# EAGLE design PAM8016-breakout (EAGLE 9.5.2)
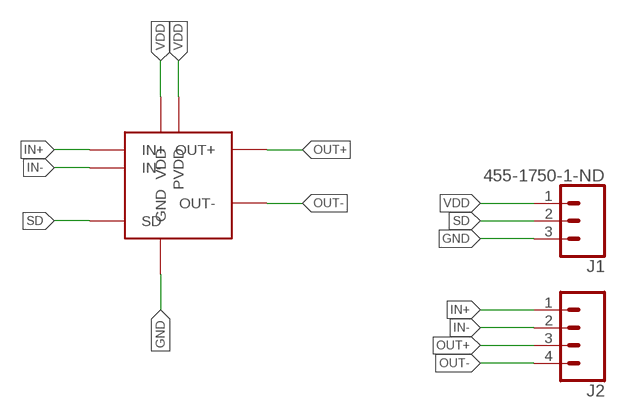
[diagram p0: schematic, sheet 1]

## Parts
J1  455-1750-1-ND  CONN_03  [1X03]
J2  CONN_04  [1X04]
U$1  PAM8016  [U-FLGA1515-9]

## Nets
GND: J1.3 U$1.A2(GND) U$1.B3(GND)
IN+: J2.1 U$1.A1(IN+)
IN-: J2.2 U$1.C1(IN-)
OUT+: J2.3 U$1.C3(OUT+)
OUT-: J2.4 U$1.A3(OUT-)
SD: J1.2 U$1.C2(SD)
VDD: J1.1 U$1.B1(VDD) U$1.B2(PVDD)

## Library data of the parts
J1 = SparkFun-Connectors:CONN_03: Multi connection point. Often used as Generic Header-pin footprint for 0.1 inch spaced/style header connections On any of the 0.1 inch spaced packages, you can populate with these: Break Away Headers - Straight <https://www.sparkfun.com/products/116> (PRT-00116) Break Away Male Headers - Right Angle <https://www.sparkfun.com/products/553> (PRT-00553) Female Headers <https://www.sparkfun.com/products/115> (PRT-00115) Break Away Headers - Machine Pin <https://www.sparkfun.com/products/117> (PRT-00117) Break Away Female Headers - Swiss Machine Pin <https://www.sparkfun.com/products/743> (PRT-00743) Stackable Header - 3 Pin (Female, 0.1") <https://www.sparkfun.com/products/13875> (PRT-13875) For SCREWTERMINALS and SPRING TERMINALS visit here: Screw Terimnals on SparkFun.com <https://www.sparkfun.com/search/results?term=Screw+Terminals> (5mm/3.5mm/2.54mm spacing) This device is also useful as a general connection point to wire up your design to another part of your project. Our various solder wires solder well into these plated through hole pads. Hook-Up Wire - Assortment (Stranded, 22 AWG) <https://www.sparkfun.com/products/11375> (PRT-11375) Hook-Up Wire - Assortment (Solid Core, 22 AWG) <https://www.sparkfun.com/products/11367> (PRT-11367) View the entire wire category on our website here <https://www.sparkfun.com/categories/141> Special notes: Molex polarized connector foot print use with SKU : PRT-08232 with associated crimp pins and housings.; PROD_ID: XXX-00000
J2 = SparkFun-Connectors:CONN_04: Multi connection point. Often used as Generic Header-pin footprint for 0.1 inch spaced/style header connections On any of the 0.1 inch spaced packages, you can populate with these: Break Away Headers - Straight <https://www.sparkfun.com/products/116> (PRT-00116) Break Away Male Headers - Right Angle <https://www.sparkfun.com/products/553> (PRT-00553) Female Headers <https://www.sparkfun.com/products/115> (PRT-00115) Break Away Headers - Machine Pin <https://www.sparkfun.com/products/117> (PRT-00117) Break Away Female Headers - Swiss Machine Pin <https://www.sparkfun.com/products/743> (PRT-00743) For SCREWTERMINALS and SPRING TERMINALS visit here: Screw Terimnals on SparkFun.com <https://www.sparkfun.com/search/results?term=Screw+Terminals> (5mm/3.5mm/2.54mm spacing) This device is also useful as a general connection point to wire up your design to another part of your project. Our various solder wires solder well into these plated through hole pads. Hook-Up Wire - Assortment (Stranded, 22 AWG) <https://www.sparkfun.com/products/11375> (PRT-11375) Hook-Up Wire - Assortment (Solid Core, 22 AWG) <https://www.sparkfun.com/products/11367> (PRT-11367) View the entire wire category on our website here <https://www.sparkfun.com/categories/141> Special notes: Molex polarized connector foot print use with SKU : PRT-08231 with associated crimp pins and housings. 1MM SMD Version SKU: PRT-10208; PROD_ID: CONN-09696
U$1 = Sparky:PAM8016

## Net classes
0 default: width 0.203 mm

## Board
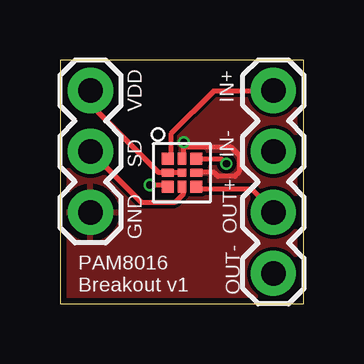
[diagram p1: board, top side]
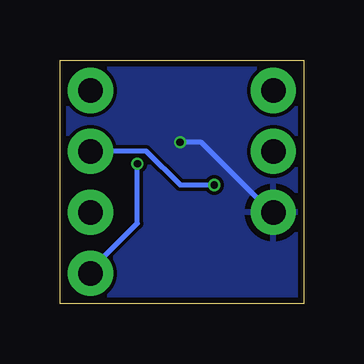
[diagram p2: board, bottom side, seen from below]

Size 10.16 x 10.16 mm. Coordinates in mm from the lower left corner, seen from the top.
Outline: 0,0 10.16,0 10.16,10.16 0,10.16 0,0
Copper layers (1*16): Top 0.035mm / dielectric 1.5mm / Bottom 0.035mm
Design rules "PCBWayMin *": minimum track width 6mil, minimum drill 0.3mm, track to track 6mil, track to pad 6mil, pad to pad 6mil, via to via 6mil, smd to smd 0mil, copper to edge 10mil, drill to drill 8mil, minimum pad ring 6mil, minimum via ring 4mil, stop-mask expansion 4mil, vias tented up to drill 25mil, thermal gap 10mil

### Footprints (pad centres in the part's own frame; a part is rotated, then mirrored left to right if it is on the bottom)
1X03 = drill 1.016 pad 1.88: 1 0,0; 2 2.54,0; 3 5.08,0
1X04 = drill 1.016 pad 1.88: 1 0,0; 2 2.54,0; 3 5.08,0; 4 7.62,0
U-FLGA1515-9 = smd 0.5 x 0.5: A1 -0.588,0.588; A3 0.588,0.588; C1 -0.588,-0.588; C3 0.588,-0.588 | smd 0.35 x 0.5: A2 0,0.588; C2 0,-0.588 | smd 0.5 x 0.35: B1 -0.588,0; B3 0.588,0 | smd 0.35 x 0.35: B2 0,0

### Placement (x,y rotation side)
J1  1.27,8.89 270 top
J2  8.89,8.89 270 top
U$1  5.08,5.46 0 top

### Tracks (layer width: path | path; a pad name or v marks a point on that pad's centre or on a via)
GND  (via drill 0.3)
  Top 0.203: 5.16,6.55 7.11,6.55 7.47,6.2 7.47,5.49 7.29,5.31 6.58,5.31 6.4,5.49 5.69,5.49 U$1.B3 | 5.16,6.55 5.16,6.2 U$1.A2 | v5.16,6.73 5.16,6.55
  Bottom 0.203: v5.16,6.73 4.27,6.73 1.42,3.89 J1.3
  pour Top: 0,10.16 10.16,10.16 10.16,0 0,0
  pour Bottom: 0,10.16 10.16,10.16 10.16,0 0,0
IN+
  Top 0.203: U$1.A1 4.62,6.2 4.62,7.09 6.4,8.87 8.89,8.87 J2.1
IN-  (via drill 0.3)
  Top 0.203: v3.73,4.95 4.45,4.95 U$1.C1
  Bottom 0.203: v3.73,4.95 5.16,4.95 6.58,6.38 8.89,6.38 J2.2
OUT+
  Top 0.203: U$1.C3 5.69,4.78 8,4.78 8.89,3.89 J2.3
OUT-  (via drill 0.3)
  Top 0.203: v6.93,5.84 6.76,6.02 5.69,6.02 U$1.A3
  Bottom 0.203: v6.93,5.84 6.93,3.35 8.89,1.4 J2.4
SD
  Top 0.203: J1.2 3.38,4.24 4.8,4.24 5.16,4.6 5.16,4.78 U$1.C2
VDD
  Top 0.203: U$1.B2 4.98,5.49 4.62,5.49 U$1.B1 4.45,5.49 4.09,5.49 1.42,8.15 1.42,8.87 J1.1

### Text on the board
tNames: VDD | IN+ | SD | IN- | GND | OUT+ | PAM8016 / Breakout v1 | OUT-